# EAGLE schematic half-moon-earring (EAGLE 9.6.2)
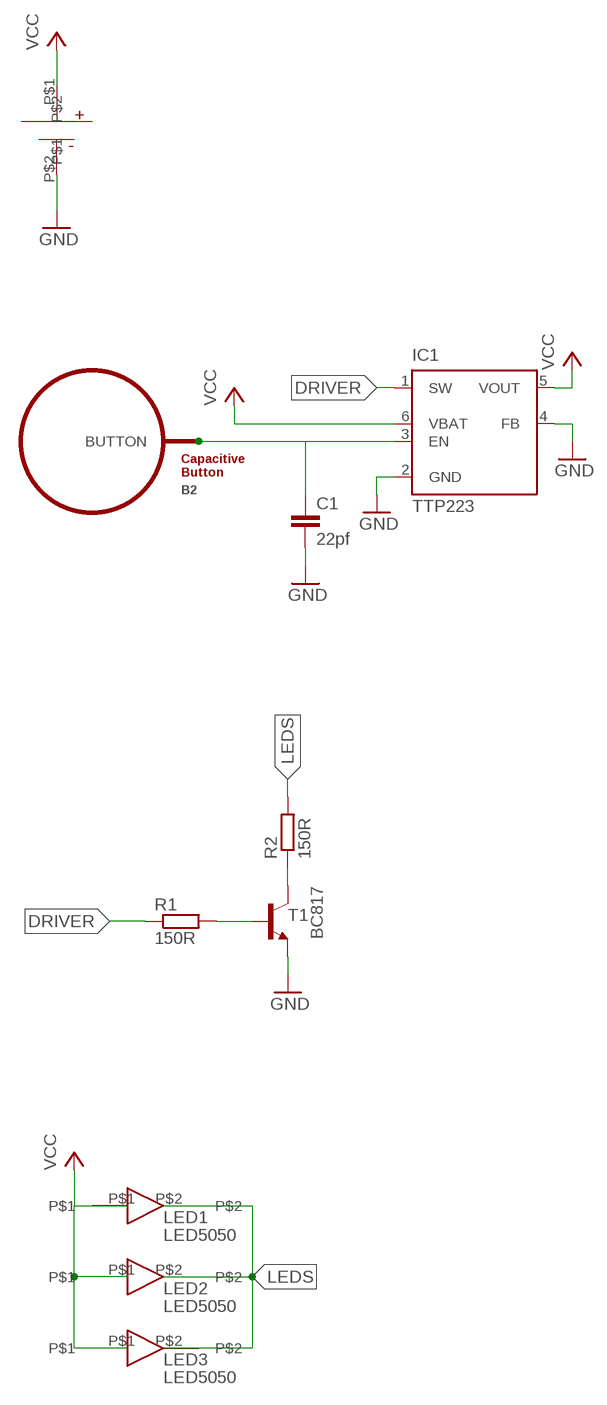
[diagram p0: schematic, sheet 1]

## Parts
B2  BUTTON_PASSIVE8MM  [BUTTON_PASSIVE_8MM]
C1  22pf  C-EUC0805  [C0805]
IC1  TTP223  TPS61070DDC  [TSOT23-6_DDC]
LED1  LED5050  [LED5050]
LED2  LED5050  [LED5050]
LED3  LED5050  [LED5050]
R1  150R  R-EU_M0805  [M0805]
R2  150R  R-EU_M0805  [M0805]
T1  BC817  BC817-16LT1-NPN-SOT23-BEC  [SOT23-BEC]
U$1  CR2035  [CR2035]

## Nets
DRIVER: IC1.1(SW) R1.1
GND: C1.2 IC1.2(GND) IC1.4(FB) T1.E U$1.P$2
LEDS: LED1.P$2 LED2.P$2 LED3.P$2 R2.2
N$2: R1.2 T1.B
N$3: R2.1 T1.C
N$11: B2.BUTTON C1.1 IC1.3(EN)
VCC: IC1.5(VOUT) IC1.6(VBAT) LED1.P$1 LED2.P$1 LED3.P$1 U$1.P$1

## Library data of the parts
B2 = PatternAgents-TouchWidgets:BUTTON_PASSIVE: Button, Passive Capacitive/Touch Sensing Type Source : http://www.PatternAgents.com Github : https://github.com/PatternAgents License : http://creativecommons.org/licenses/by-sa/3.1/ (Creative Commons 3.1) THIS SOFTWARE IS PROVIDED BY THE CONTRIBUTORS "AS IS" AND WITHOUT ANY EXPRESS OR IMPLIED WARRANTIES, INCLUDING, BUT NOT LIMITED TO, THE IMPLIED WARRANTIES OF MERCHANTABILITY AND FITNESS FOR A PARTICULAR PURPOSE ARE DISCLAIMED. IN NO EVENT SHALL THE COPYRIGHT OWNER OR CONTRIBUTORS BE LIABLE FOR ANY DIRECT, INDIRECT, INCIDENTAL, SPECIAL, EXEMPLARY, OR CONSEQUENTIAL DAMAGES (INCLUDING, BUT NOT LIMITED TO, PROCUREMENT OF SUBSTITUTE GOODS OR SERVICES; LOSS OF USE, DATA, OR PROFITS; OR BUSINESS INTERRUPTION) HOWEVER CAUSED AND ON ANY THEORY OF LIABILITY, WHETHER IN CONTRACT, STRICT LIABILITY, OR TORT (INCLUDING NEGLIGENCE OR OTHERWISE) ARISING IN ANY WAY OUT OF THE USE OF THIS SOFTWARE, EVEN IF ADVISED OF THE POSSIBILITY OF SUCH DAMAGE.
C1 = rcl:C-EU: CAPACITOR, European symbol; SPICEPREFIX: C
IC1 = texas:TPS6107*: 90% EFFICIENT SYNCHRONOUS BOOST CONVERTER WITH 600-mA SWITCH Source: http://focus.ti.com/lit/ds/symlink/tps61070.pdf; MPN: TPS61070DDCR; OC_FARNELL: 1461062; OC_NEWARK: 64M3125
LED1-LED3 = Eletroblocks Lib:LED5050
R1 R2 = rcl:R-EU_: RESISTOR, European symbol; SPICEPREFIX: R
T1 = transistor:*-NPN-: NPN Transistror BF959 corrected 2008.03.06
U$1 = cr2025:CR2035